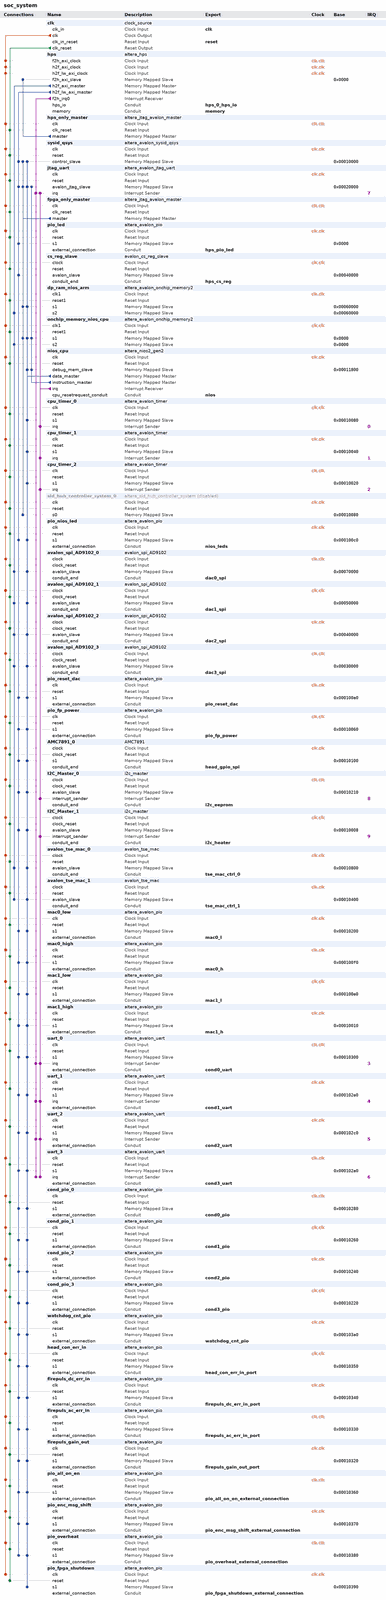
[diagram p0: system contents, whole]
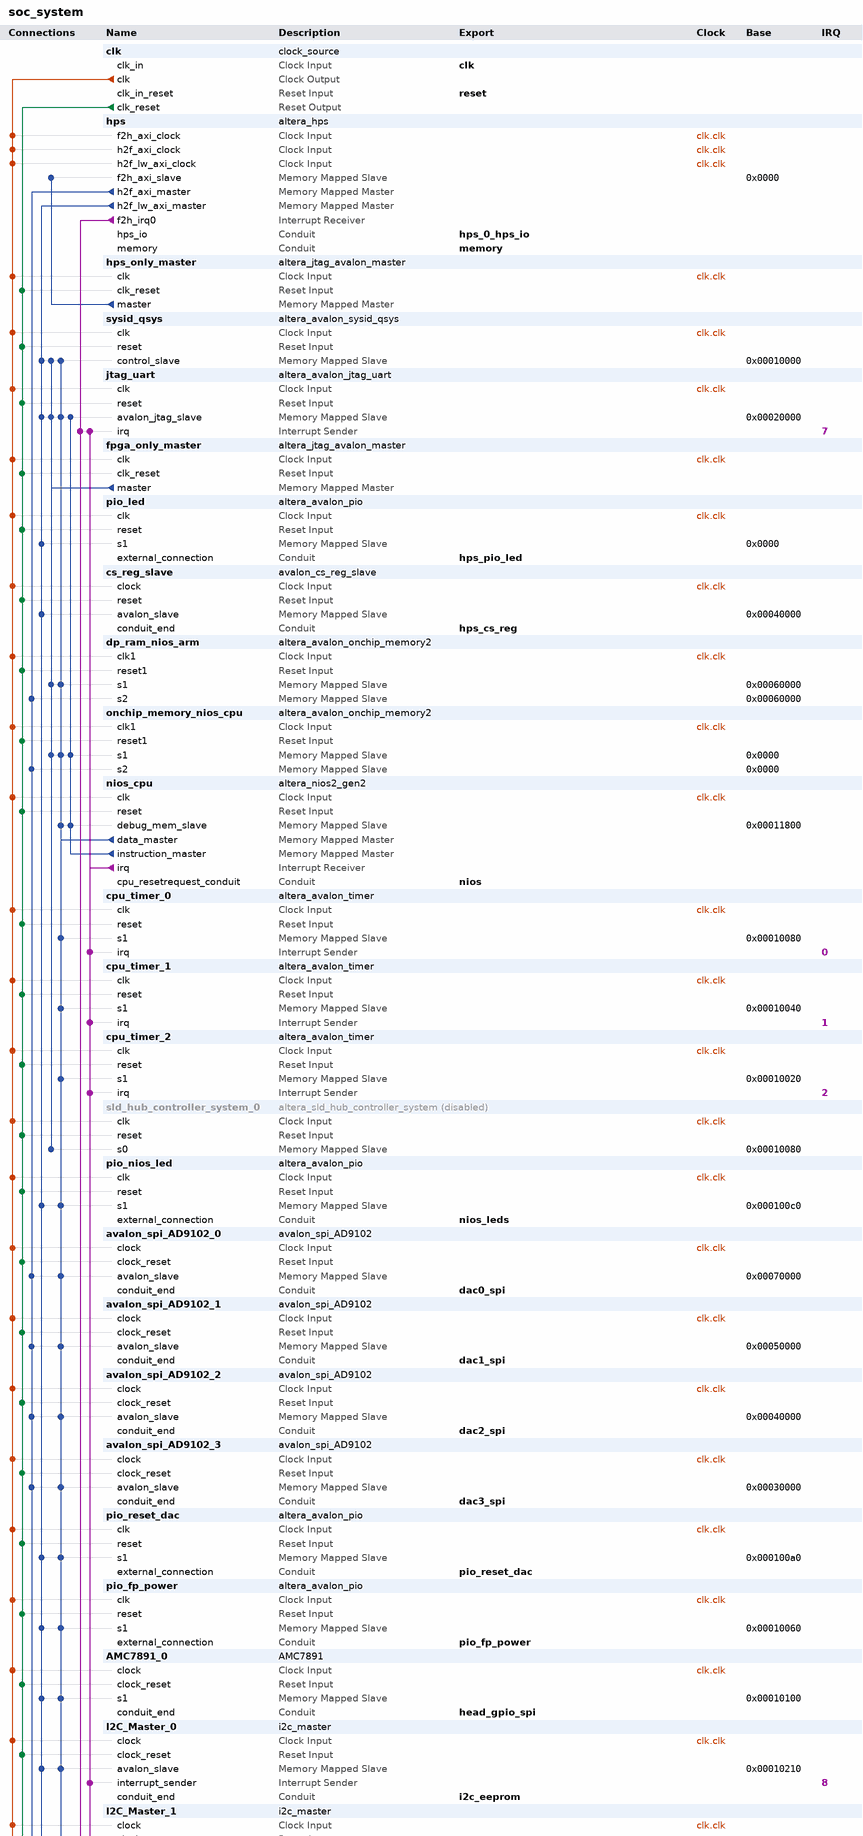
[diagram p1: system contents, upper part]
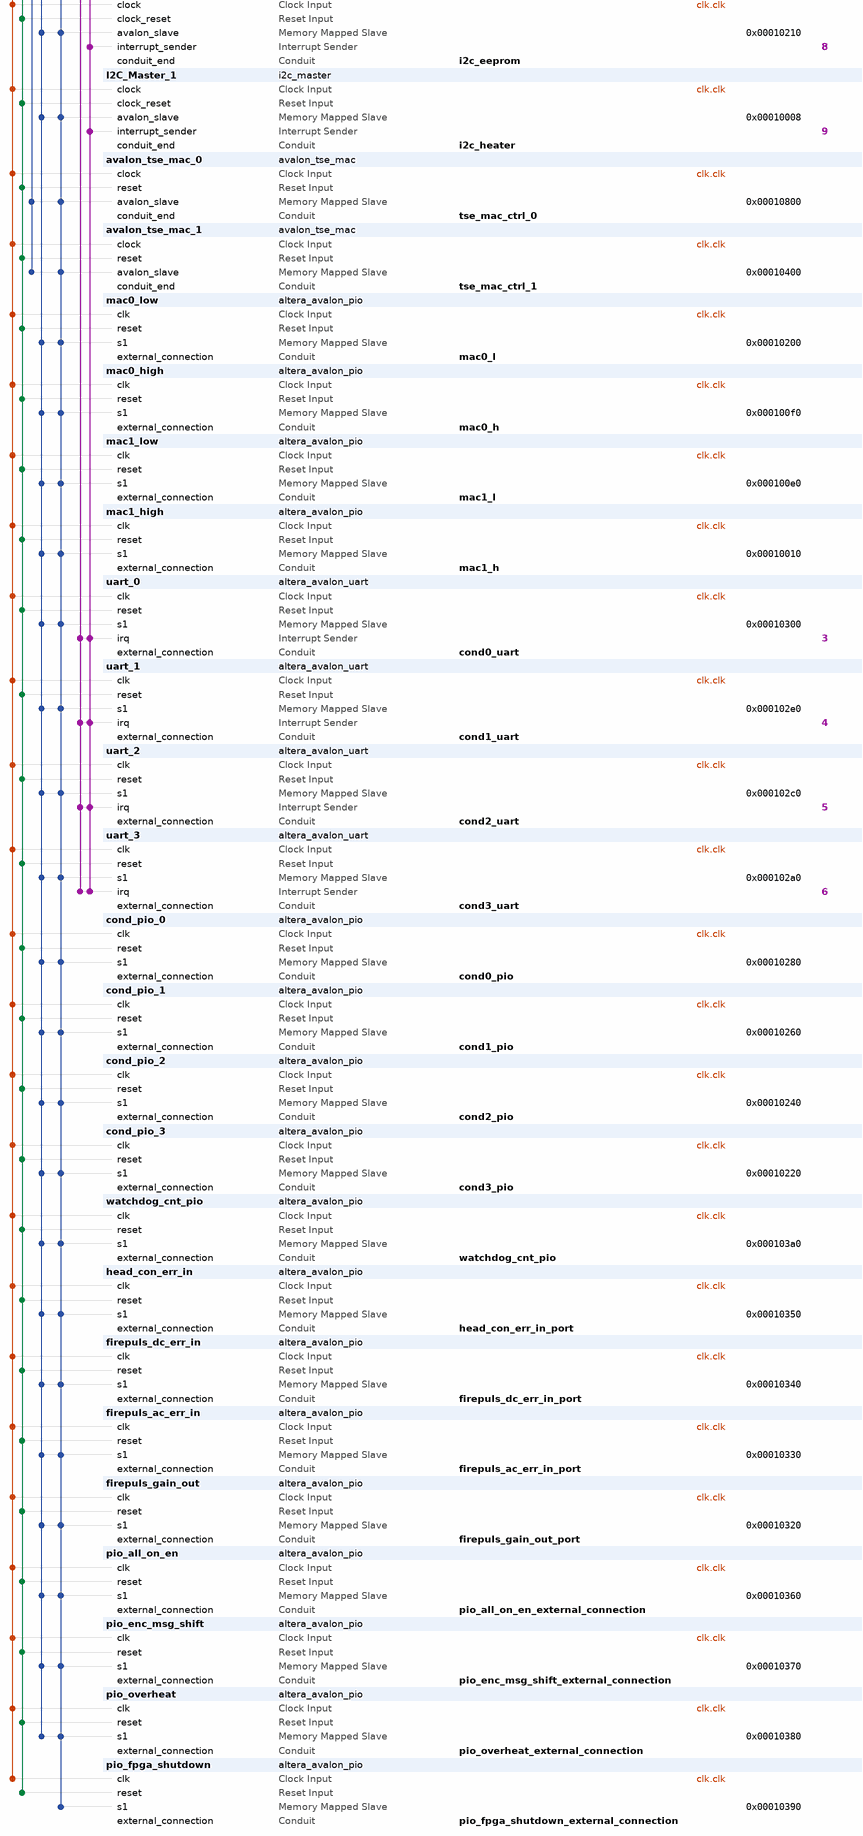
[diagram p2: system contents, lower part]
# Platform Designer (Qsys) system soc_system, Arria V 5ASXMB3G6F40C6
# Parameters at their usual value, and those the tool derives, are not listed.
package require -exact qsys 17.1
create_system soc_system
set_project_property DEVICE_FAMILY {Arria V}
set_project_property DEVICE 5ASXMB3G6F40C6

add_instance clk clock_source 17.1
set_instance_parameter_value clk clockFrequency 50000000

add_instance hps altera_hps 17.1
set_instance_parameter_value hps EMAC1_Mode RGMII
set_instance_parameter_value hps EMAC1_PinMuxing {HPS I/O Set 0}
set_instance_parameter_value hps F2SCLK_COLDRST_Enable false
set_instance_parameter_value hps F2SCLK_DBGRST_Enable false
set_instance_parameter_value hps F2SCLK_WARMRST_Enable false
set_instance_parameter_value hps F2SINTERRUPT_Enable true
set_instance_parameter_value hps F2S_Width 2
set_instance_parameter_value hps FPGA_PERIPHERAL_OUTPUT_CLOCK_FREQ_EMAC0_GTX_CLK 100
set_instance_parameter_value hps FPGA_PERIPHERAL_OUTPUT_CLOCK_FREQ_EMAC0_MD_CLK 100.0
set_instance_parameter_value hps FPGA_PERIPHERAL_OUTPUT_CLOCK_FREQ_EMAC1_GTX_CLK 100
set_instance_parameter_value hps FPGA_PERIPHERAL_OUTPUT_CLOCK_FREQ_EMAC1_MD_CLK 100.0
set_instance_parameter_value hps HPS_PROTOCOL DDR3
set_instance_parameter_value hps I2C0_Mode N/A
set_instance_parameter_value hps I2C0_PinMuxing Unused
set_instance_parameter_value hps I2C1_Mode N/A
set_instance_parameter_value hps I2C1_PinMuxing Unused
set_instance_parameter_value hps LWH2F_Enable true
set_instance_parameter_value hps MEM_BANKADDR_WIDTH 3
set_instance_parameter_value hps MEM_CLK_FREQ 400.0
set_instance_parameter_value hps MEM_COL_ADDR_WIDTH 10
set_instance_parameter_value hps MEM_DQ_WIDTH 32
set_instance_parameter_value hps MEM_DRV_STR RZQ/6
set_instance_parameter_value hps MEM_ROW_ADDR_WIDTH 15
set_instance_parameter_value hps MEM_RTT_NOM RZQ/4
set_instance_parameter_value hps MEM_RTT_WR {Dynamic ODT off}
set_instance_parameter_value hps MEM_TCL 7
set_instance_parameter_value hps MEM_TFAW_NS 40.0
set_instance_parameter_value hps MEM_TRAS_NS 35.0
set_instance_parameter_value hps MEM_TRCD_NS 13.75
set_instance_parameter_value hps MEM_TRFC_NS 260.0
set_instance_parameter_value hps MEM_TRP_NS 13.75
set_instance_parameter_value hps MEM_TRRD_NS 10.0
set_instance_parameter_value hps MEM_TRTP_NS 10.0
set_instance_parameter_value hps MEM_VENDOR Samsung
set_instance_parameter_value hps MEM_WTCL 6
set_instance_parameter_value hps QSPI_Mode {1 SS}
set_instance_parameter_value hps QSPI_PinMuxing {HPS I/O Set 0}
set_instance_parameter_value hps REF_CLK_FREQ 25.0
set_instance_parameter_value hps S2FCLK_USER2CLK 1
set_instance_parameter_value hps S2F_Width 2
set_instance_parameter_value hps SDIO_Mode {4-bit Data}
set_instance_parameter_value hps SDIO_PinMuxing {HPS I/O Set 0}
set_instance_parameter_value hps SPIM1_Mode N/A
set_instance_parameter_value hps SPIM1_PinMuxing Unused
set_instance_parameter_value hps STM_Enable false
set_instance_parameter_value hps TIMING_BOARD_AC_SKEW 0.0
set_instance_parameter_value hps TIMING_BOARD_AC_TO_CK_SKEW 0.0
set_instance_parameter_value hps TIMING_BOARD_DQ_TO_DQS_SKEW 0.0
set_instance_parameter_value hps TIMING_BOARD_MAX_CK_DELAY 0.36
set_instance_parameter_value hps TIMING_BOARD_MAX_DQS_DELAY 0.21
set_instance_parameter_value hps TIMING_BOARD_SKEW_BETWEEN_DQS 0.0
set_instance_parameter_value hps TIMING_BOARD_SKEW_CKDQS_DIMM_MAX 0.15
set_instance_parameter_value hps TIMING_BOARD_SKEW_CKDQS_DIMM_MIN 0.15
set_instance_parameter_value hps TIMING_BOARD_SKEW_WITHIN_DQS 0.0
set_instance_parameter_value hps TIMING_TDH 45
set_instance_parameter_value hps TIMING_TDQSCK 225
set_instance_parameter_value hps TIMING_TDQSQ 100
set_instance_parameter_value hps TIMING_TDQSS 0.27
set_instance_parameter_value hps TIMING_TDS 10
set_instance_parameter_value hps TIMING_TDSH 0.18
set_instance_parameter_value hps TIMING_TDSS 0.18
set_instance_parameter_value hps TIMING_TIH 120
set_instance_parameter_value hps TIMING_TIS 170
set_instance_parameter_value hps TIMING_TQSH 0.4
set_instance_parameter_value hps UART0_Mode {No Flow Control}
set_instance_parameter_value hps UART0_PinMuxing {HPS I/O Set 1}
set_instance_parameter_value hps USB1_Mode N/A
set_instance_parameter_value hps USB1_PinMuxing Unused
set_instance_parameter_value hps desired_cfg_clk_mhz 100.0
set_instance_parameter_value hps desired_qspi_clk_mhz 350.0

add_instance hps_only_master altera_jtag_avalon_master 17.1

add_instance sysid_qsys altera_avalon_sysid_qsys 17.1
set_instance_parameter_value sysid_qsys id -1395322108

add_instance jtag_uart altera_avalon_jtag_uart 17.1
set_instance_parameter_value jtag_uart allowMultipleConnections true
set_instance_parameter_value jtag_uart simInteractiveOptions INTERACTIVE_ASCII_OUTPUT

add_instance fpga_only_master altera_jtag_avalon_master 17.1

add_instance pio_led altera_avalon_pio 17.1
set_instance_parameter_value pio_led direction Output
set_instance_parameter_value pio_led width 1

add_instance cs_reg_slave avalon_cs_reg_slave 1.0
set_instance_parameter_value cs_reg_slave g_addr_width 16
set_instance_parameter_value cs_reg_slave g_data_width 32

add_instance dp_ram_nios_arm altera_avalon_onchip_memory2 17.1
set_instance_parameter_value dp_ram_nios_arm dataWidth 16
set_instance_parameter_value dp_ram_nios_arm dualPort true
set_instance_parameter_value dp_ram_nios_arm initMemContent true
set_instance_parameter_value dp_ram_nios_arm initializationFileName onchip_mem.hex
set_instance_parameter_value dp_ram_nios_arm memorySize 32768
set_instance_parameter_value dp_ram_nios_arm singleClockOperation true

add_instance onchip_memory_nios_cpu altera_avalon_onchip_memory2 17.1
set_instance_parameter_value onchip_memory_nios_cpu dataWidth 32
set_instance_parameter_value onchip_memory_nios_cpu dualPort true
set_instance_parameter_value onchip_memory_nios_cpu initMemContent true
set_instance_parameter_value onchip_memory_nios_cpu initializationFileName onchip_mem.hex
set_instance_parameter_value onchip_memory_nios_cpu memorySize 65536
set_instance_parameter_value onchip_memory_nios_cpu singleClockOperation true

add_instance nios_cpu altera_nios2_gen2 17.1
set_instance_parameter_value nios_cpu cpuReset true
set_instance_parameter_value nios_cpu dcache_size 0
set_instance_parameter_value nios_cpu exceptionSlave onchip_memory_nios_cpu.s1
set_instance_parameter_value nios_cpu icache_size 512
set_instance_parameter_value nios_cpu impl Fast
set_instance_parameter_value nios_cpu resetSlave onchip_memory_nios_cpu.s1
set_instance_parameter_value nios_cpu setting_activateTrace true

add_instance cpu_timer_0 altera_avalon_timer 17.1
set_instance_parameter_value cpu_timer_0 period 1
set_instance_parameter_value cpu_timer_0 periodUnits MSEC

add_instance cpu_timer_1 altera_avalon_timer 17.1
set_instance_parameter_value cpu_timer_1 period 1
set_instance_parameter_value cpu_timer_1 periodUnits MSEC

add_instance cpu_timer_2 altera_avalon_timer 17.1
set_instance_parameter_value cpu_timer_2 period 1
set_instance_parameter_value cpu_timer_2 periodUnits MSEC

add_instance sld_hub_controller_system_0 altera_sld_hub_controller_system 17.1
set_instance_property sld_hub_controller_system_0 ENABLED false
set_instance_parameter_value sld_hub_controller_system_0 ENABLE_JTAG_IO_SELECTION 0

add_instance pio_nios_led altera_avalon_pio 17.1
set_instance_parameter_value pio_nios_led bitModifyingOutReg true
set_instance_parameter_value pio_nios_led direction Output
set_instance_parameter_value pio_nios_led width 2

add_instance avalon_spi_AD9102_0 avalon_spi_AD9102 1.0

add_instance avalon_spi_AD9102_1 avalon_spi_AD9102 1.0

add_instance avalon_spi_AD9102_2 avalon_spi_AD9102 1.0

add_instance avalon_spi_AD9102_3 avalon_spi_AD9102 1.0

add_instance pio_reset_dac altera_avalon_pio 17.1
set_instance_parameter_value pio_reset_dac bitModifyingOutReg true
set_instance_parameter_value pio_reset_dac direction Output
set_instance_parameter_value pio_reset_dac width 4

add_instance pio_fp_power altera_avalon_pio 17.1
set_instance_parameter_value pio_fp_power bitModifyingOutReg true
set_instance_parameter_value pio_fp_power direction Output
set_instance_parameter_value pio_fp_power width 1

add_instance AMC7891_0 AMC7891 1.0

add_instance I2C_Master_0 i2c_master 14.0

add_instance I2C_Master_1 i2c_master 14.0

add_instance avalon_tse_mac_0 avalon_tse_mac 1.0

add_instance avalon_tse_mac_1 avalon_tse_mac 1.0

add_instance mac0_low altera_avalon_pio 17.1
set_instance_parameter_value mac0_low direction Input
set_instance_parameter_value mac0_low width 32

add_instance mac0_high altera_avalon_pio 17.1
set_instance_parameter_value mac0_high direction Input
set_instance_parameter_value mac0_high width 16

add_instance mac1_low altera_avalon_pio 17.1
set_instance_parameter_value mac1_low direction Input
set_instance_parameter_value mac1_low width 32

add_instance mac1_high altera_avalon_pio 17.1
set_instance_parameter_value mac1_high direction Input
set_instance_parameter_value mac1_high width 16

add_instance uart_0 altera_avalon_uart 17.1
set_instance_parameter_value uart_0 baud 115200
set_instance_parameter_value uart_0 dataBits 8
set_instance_parameter_value uart_0 fixedBaud false
set_instance_parameter_value uart_0 parity NONE
set_instance_parameter_value uart_0 stopBits 1

add_instance uart_1 altera_avalon_uart 17.1
set_instance_parameter_value uart_1 baud 115200
set_instance_parameter_value uart_1 dataBits 8
set_instance_parameter_value uart_1 fixedBaud false
set_instance_parameter_value uart_1 parity NONE
set_instance_parameter_value uart_1 stopBits 1

add_instance uart_2 altera_avalon_uart 17.1
set_instance_parameter_value uart_2 baud 115200
set_instance_parameter_value uart_2 dataBits 8
set_instance_parameter_value uart_2 fixedBaud false
set_instance_parameter_value uart_2 parity NONE
set_instance_parameter_value uart_2 stopBits 1

add_instance uart_3 altera_avalon_uart 17.1
set_instance_parameter_value uart_3 baud 115200
set_instance_parameter_value uart_3 dataBits 8
set_instance_parameter_value uart_3 fixedBaud false
set_instance_parameter_value uart_3 parity NONE
set_instance_parameter_value uart_3 stopBits 1

add_instance cond_pio_0 altera_avalon_pio 17.1
set_instance_parameter_value cond_pio_0 bitModifyingOutReg true
set_instance_parameter_value cond_pio_0 direction Output
set_instance_parameter_value cond_pio_0 resetValue 1
set_instance_parameter_value cond_pio_0 width 4

add_instance cond_pio_1 altera_avalon_pio 17.1
set_instance_parameter_value cond_pio_1 bitModifyingOutReg true
set_instance_parameter_value cond_pio_1 direction Output
set_instance_parameter_value cond_pio_1 resetValue 1
set_instance_parameter_value cond_pio_1 width 4

add_instance cond_pio_2 altera_avalon_pio 17.1
set_instance_parameter_value cond_pio_2 bitModifyingOutReg true
set_instance_parameter_value cond_pio_2 direction Output
set_instance_parameter_value cond_pio_2 resetValue 1
set_instance_parameter_value cond_pio_2 width 4

add_instance cond_pio_3 altera_avalon_pio 17.1
set_instance_parameter_value cond_pio_3 bitModifyingOutReg true
set_instance_parameter_value cond_pio_3 direction Output
set_instance_parameter_value cond_pio_3 resetValue 1
set_instance_parameter_value cond_pio_3 width 4

add_instance watchdog_cnt_pio altera_avalon_pio 17.1
set_instance_parameter_value watchdog_cnt_pio bitModifyingOutReg true
set_instance_parameter_value watchdog_cnt_pio direction Output
set_instance_parameter_value watchdog_cnt_pio width 32

add_instance head_con_err_in altera_avalon_pio 17.1
set_instance_parameter_value head_con_err_in direction Input
set_instance_parameter_value head_con_err_in width 4

add_instance firepuls_dc_err_in altera_avalon_pio 17.1
set_instance_parameter_value firepuls_dc_err_in direction Input
set_instance_parameter_value firepuls_dc_err_in width 4

add_instance firepuls_ac_err_in altera_avalon_pio 17.1
set_instance_parameter_value firepuls_ac_err_in direction Input
set_instance_parameter_value firepuls_ac_err_in width 4

add_instance firepuls_gain_out altera_avalon_pio 17.1
set_instance_parameter_value firepuls_gain_out direction Output
set_instance_parameter_value firepuls_gain_out width 4

add_instance pio_all_on_en altera_avalon_pio 17.1
set_instance_parameter_value pio_all_on_en direction Output
set_instance_parameter_value pio_all_on_en width 1

add_instance pio_enc_msg_shift altera_avalon_pio 17.1
set_instance_parameter_value pio_enc_msg_shift direction Output
set_instance_parameter_value pio_enc_msg_shift width 2

add_instance pio_overheat altera_avalon_pio 17.1
set_instance_parameter_value pio_overheat captureEdge true
set_instance_parameter_value pio_overheat direction Input
set_instance_parameter_value pio_overheat irqType EDGE
set_instance_parameter_value pio_overheat width 1

add_instance pio_fpga_shutdown altera_avalon_pio 17.1
set_instance_parameter_value pio_fpga_shutdown direction Output
set_instance_parameter_value pio_fpga_shutdown width 1

# connections
add_connection clk.clk AMC7891_0.clock clock
add_connection clk.clk avalon_spi_AD9102_0.clock clock
add_connection clk.clk avalon_spi_AD9102_1.clock clock
add_connection clk.clk avalon_spi_AD9102_2.clock clock
add_connection clk.clk avalon_spi_AD9102_3.clock clock
add_connection clk.clk avalon_tse_mac_0.clock clock
add_connection clk.clk avalon_tse_mac_1.clock clock
add_connection clk.clk cond_pio_0.clk clock
add_connection clk.clk cond_pio_1.clk clock
add_connection clk.clk cond_pio_2.clk clock
add_connection clk.clk cond_pio_3.clk clock
add_connection clk.clk cpu_timer_0.clk clock
add_connection clk.clk cpu_timer_1.clk clock
add_connection clk.clk cpu_timer_2.clk clock
add_connection clk.clk cs_reg_slave.clock clock
add_connection clk.clk dp_ram_nios_arm.clk1 clock
add_connection clk.clk firepuls_ac_err_in.clk clock
add_connection clk.clk firepuls_dc_err_in.clk clock
add_connection clk.clk firepuls_gain_out.clk clock
add_connection clk.clk fpga_only_master.clk clock
add_connection clk.clk head_con_err_in.clk clock
add_connection clk.clk hps.f2h_axi_clock clock
add_connection clk.clk hps.h2f_axi_clock clock
add_connection clk.clk hps.h2f_lw_axi_clock clock
add_connection clk.clk hps_only_master.clk clock
add_connection clk.clk I2C_Master_0.clock clock
add_connection clk.clk I2C_Master_1.clock clock
add_connection clk.clk jtag_uart.clk clock
add_connection clk.clk mac0_high.clk clock
add_connection clk.clk mac0_low.clk clock
add_connection clk.clk mac1_high.clk clock
add_connection clk.clk mac1_low.clk clock
add_connection clk.clk nios_cpu.clk clock
add_connection clk.clk onchip_memory_nios_cpu.clk1 clock
add_connection clk.clk pio_all_on_en.clk clock
add_connection clk.clk pio_enc_msg_shift.clk clock
add_connection clk.clk pio_fp_power.clk clock
add_connection clk.clk pio_fpga_shutdown.clk clock
add_connection clk.clk pio_led.clk clock
add_connection clk.clk pio_nios_led.clk clock
add_connection clk.clk pio_overheat.clk clock
add_connection clk.clk pio_reset_dac.clk clock
add_connection clk.clk sld_hub_controller_system_0.clk clock
add_connection clk.clk sysid_qsys.clk clock
add_connection clk.clk uart_0.clk clock
add_connection clk.clk uart_1.clk clock
add_connection clk.clk uart_2.clk clock
add_connection clk.clk uart_3.clk clock
add_connection clk.clk watchdog_cnt_pio.clk clock
add_connection clk.clk_reset AMC7891_0.clock_reset reset
add_connection clk.clk_reset avalon_spi_AD9102_0.clock_reset reset
add_connection clk.clk_reset avalon_spi_AD9102_1.clock_reset reset
add_connection clk.clk_reset avalon_spi_AD9102_2.clock_reset reset
add_connection clk.clk_reset avalon_spi_AD9102_3.clock_reset reset
add_connection clk.clk_reset avalon_tse_mac_0.reset reset
add_connection clk.clk_reset avalon_tse_mac_1.reset reset
add_connection clk.clk_reset cond_pio_0.reset reset
add_connection clk.clk_reset cond_pio_1.reset reset
add_connection clk.clk_reset cond_pio_2.reset reset
add_connection clk.clk_reset cond_pio_3.reset reset
add_connection clk.clk_reset cpu_timer_0.reset reset
add_connection clk.clk_reset cpu_timer_1.reset reset
add_connection clk.clk_reset cpu_timer_2.reset reset
add_connection clk.clk_reset cs_reg_slave.reset reset
add_connection clk.clk_reset dp_ram_nios_arm.reset1 reset
add_connection clk.clk_reset firepuls_ac_err_in.reset reset
add_connection clk.clk_reset firepuls_dc_err_in.reset reset
add_connection clk.clk_reset firepuls_gain_out.reset reset
add_connection clk.clk_reset fpga_only_master.clk_reset reset
add_connection clk.clk_reset head_con_err_in.reset reset
add_connection clk.clk_reset hps_only_master.clk_reset reset
add_connection clk.clk_reset I2C_Master_0.clock_reset reset
add_connection clk.clk_reset I2C_Master_1.clock_reset reset
add_connection clk.clk_reset jtag_uart.reset reset
add_connection clk.clk_reset mac0_high.reset reset
add_connection clk.clk_reset mac0_low.reset reset
add_connection clk.clk_reset mac1_high.reset reset
add_connection clk.clk_reset mac1_low.reset reset
add_connection clk.clk_reset nios_cpu.reset reset
add_connection clk.clk_reset onchip_memory_nios_cpu.reset1 reset
add_connection clk.clk_reset pio_all_on_en.reset reset
add_connection clk.clk_reset pio_enc_msg_shift.reset reset
add_connection clk.clk_reset pio_fp_power.reset reset
add_connection clk.clk_reset pio_fpga_shutdown.reset reset
add_connection clk.clk_reset pio_led.reset reset
add_connection clk.clk_reset pio_nios_led.reset reset
add_connection clk.clk_reset pio_overheat.reset reset
add_connection clk.clk_reset pio_reset_dac.reset reset
add_connection clk.clk_reset sld_hub_controller_system_0.reset reset
add_connection clk.clk_reset sysid_qsys.reset reset
add_connection clk.clk_reset uart_0.reset reset
add_connection clk.clk_reset uart_1.reset reset
add_connection clk.clk_reset uart_2.reset reset
add_connection clk.clk_reset uart_3.reset reset
add_connection clk.clk_reset watchdog_cnt_pio.reset reset
add_connection fpga_only_master.master dp_ram_nios_arm.s1 avalon
set_connection_parameter_value fpga_only_master.master/dp_ram_nios_arm.s1 baseAddress 0x00060000
add_connection fpga_only_master.master jtag_uart.avalon_jtag_slave avalon
set_connection_parameter_value fpga_only_master.master/jtag_uart.avalon_jtag_slave baseAddress 0x00020000
add_connection fpga_only_master.master onchip_memory_nios_cpu.s1 avalon
set_connection_parameter_value fpga_only_master.master/onchip_memory_nios_cpu.s1 baseAddress 0x0000
add_connection fpga_only_master.master sld_hub_controller_system_0.s0 avalon
set_connection_parameter_value fpga_only_master.master/sld_hub_controller_system_0.s0 baseAddress 0x00010080
add_connection fpga_only_master.master sysid_qsys.control_slave avalon
set_connection_parameter_value fpga_only_master.master/sysid_qsys.control_slave baseAddress 0x00010000
add_connection hps.h2f_axi_master avalon_spi_AD9102_0.avalon_slave avalon
set_connection_parameter_value hps.h2f_axi_master/avalon_spi_AD9102_0.avalon_slave baseAddress 0x00070000
add_connection hps.h2f_axi_master avalon_spi_AD9102_1.avalon_slave avalon
set_connection_parameter_value hps.h2f_axi_master/avalon_spi_AD9102_1.avalon_slave baseAddress 0x00050000
add_connection hps.h2f_axi_master avalon_spi_AD9102_2.avalon_slave avalon
set_connection_parameter_value hps.h2f_axi_master/avalon_spi_AD9102_2.avalon_slave baseAddress 0x00040000
add_connection hps.h2f_axi_master avalon_spi_AD9102_3.avalon_slave avalon
set_connection_parameter_value hps.h2f_axi_master/avalon_spi_AD9102_3.avalon_slave baseAddress 0x00030000
add_connection hps.h2f_axi_master avalon_tse_mac_0.avalon_slave avalon
set_connection_parameter_value hps.h2f_axi_master/avalon_tse_mac_0.avalon_slave baseAddress 0x00010800
add_connection hps.h2f_axi_master avalon_tse_mac_1.avalon_slave avalon
set_connection_parameter_value hps.h2f_axi_master/avalon_tse_mac_1.avalon_slave baseAddress 0x00010400
add_connection hps.h2f_axi_master dp_ram_nios_arm.s2 avalon
set_connection_parameter_value hps.h2f_axi_master/dp_ram_nios_arm.s2 baseAddress 0x00060000
add_connection hps.h2f_axi_master onchip_memory_nios_cpu.s2 avalon
set_connection_parameter_value hps.h2f_axi_master/onchip_memory_nios_cpu.s2 baseAddress 0x0000
add_connection hps.h2f_lw_axi_master AMC7891_0.s1 avalon
set_connection_parameter_value hps.h2f_lw_axi_master/AMC7891_0.s1 baseAddress 0x00010100
add_connection hps.h2f_lw_axi_master cond_pio_0.s1 avalon
set_connection_parameter_value hps.h2f_lw_axi_master/cond_pio_0.s1 baseAddress 0x00010280
add_connection hps.h2f_lw_axi_master cond_pio_1.s1 avalon
set_connection_parameter_value hps.h2f_lw_axi_master/cond_pio_1.s1 baseAddress 0x00010260
add_connection hps.h2f_lw_axi_master cond_pio_2.s1 avalon
set_connection_parameter_value hps.h2f_lw_axi_master/cond_pio_2.s1 baseAddress 0x00010240
add_connection hps.h2f_lw_axi_master cond_pio_3.s1 avalon
set_connection_parameter_value hps.h2f_lw_axi_master/cond_pio_3.s1 baseAddress 0x00010220
add_connection hps.h2f_lw_axi_master cs_reg_slave.avalon_slave avalon
set_connection_parameter_value hps.h2f_lw_axi_master/cs_reg_slave.avalon_slave baseAddress 0x00040000
add_connection hps.h2f_lw_axi_master firepuls_ac_err_in.s1 avalon
set_connection_parameter_value hps.h2f_lw_axi_master/firepuls_ac_err_in.s1 baseAddress 0x00010330
add_connection hps.h2f_lw_axi_master firepuls_dc_err_in.s1 avalon
set_connection_parameter_value hps.h2f_lw_axi_master/firepuls_dc_err_in.s1 baseAddress 0x00010340
add_connection hps.h2f_lw_axi_master firepuls_gain_out.s1 avalon
set_connection_parameter_value hps.h2f_lw_axi_master/firepuls_gain_out.s1 baseAddress 0x00010320
add_connection hps.h2f_lw_axi_master head_con_err_in.s1 avalon
set_connection_parameter_value hps.h2f_lw_axi_master/head_con_err_in.s1 baseAddress 0x00010350
add_connection hps.h2f_lw_axi_master I2C_Master_0.avalon_slave avalon
set_connection_parameter_value hps.h2f_lw_axi_master/I2C_Master_0.avalon_slave baseAddress 0x00010210
add_connection hps.h2f_lw_axi_master I2C_Master_1.avalon_slave avalon
set_connection_parameter_value hps.h2f_lw_axi_master/I2C_Master_1.avalon_slave baseAddress 0x00010008
add_connection hps.h2f_lw_axi_master jtag_uart.avalon_jtag_slave avalon
set_connection_parameter_value hps.h2f_lw_axi_master/jtag_uart.avalon_jtag_slave baseAddress 0x00020000
add_connection hps.h2f_lw_axi_master mac0_high.s1 avalon
set_connection_parameter_value hps.h2f_lw_axi_master/mac0_high.s1 baseAddress 0x000100f0
add_connection hps.h2f_lw_axi_master mac0_low.s1 avalon
set_connection_parameter_value hps.h2f_lw_axi_master/mac0_low.s1 baseAddress 0x00010200
add_connection hps.h2f_lw_axi_master mac1_high.s1 avalon
set_connection_parameter_value hps.h2f_lw_axi_master/mac1_high.s1 baseAddress 0x00010010
add_connection hps.h2f_lw_axi_master mac1_low.s1 avalon
set_connection_parameter_value hps.h2f_lw_axi_master/mac1_low.s1 baseAddress 0x000100e0
add_connection hps.h2f_lw_axi_master pio_all_on_en.s1 avalon
set_connection_parameter_value hps.h2f_lw_axi_master/pio_all_on_en.s1 baseAddress 0x00010360
add_connection hps.h2f_lw_axi_master pio_enc_msg_shift.s1 avalon
set_connection_parameter_value hps.h2f_lw_axi_master/pio_enc_msg_shift.s1 baseAddress 0x00010370
add_connection hps.h2f_lw_axi_master pio_fp_power.s1 avalon
set_connection_parameter_value hps.h2f_lw_axi_master/pio_fp_power.s1 baseAddress 0x00010060
add_connection hps.h2f_lw_axi_master pio_led.s1 avalon
set_connection_parameter_value hps.h2f_lw_axi_master/pio_led.s1 baseAddress 0x0000
add_connection hps.h2f_lw_axi_master pio_nios_led.s1 avalon
set_connection_parameter_value hps.h2f_lw_axi_master/pio_nios_led.s1 baseAddress 0x000100c0
add_connection hps.h2f_lw_axi_master pio_overheat.s1 avalon
set_connection_parameter_value hps.h2f_lw_axi_master/pio_overheat.s1 baseAddress 0x00010380
add_connection hps.h2f_lw_axi_master pio_reset_dac.s1 avalon
set_connection_parameter_value hps.h2f_lw_axi_master/pio_reset_dac.s1 baseAddress 0x000100a0
add_connection hps.h2f_lw_axi_master sysid_qsys.control_slave avalon
set_connection_parameter_value hps.h2f_lw_axi_master/sysid_qsys.control_slave baseAddress 0x00010000
add_connection hps.h2f_lw_axi_master uart_0.s1 avalon
set_connection_parameter_value hps.h2f_lw_axi_master/uart_0.s1 baseAddress 0x00010300
add_connection hps.h2f_lw_axi_master uart_1.s1 avalon
set_connection_parameter_value hps.h2f_lw_axi_master/uart_1.s1 baseAddress 0x000102e0
add_connection hps.h2f_lw_axi_master uart_2.s1 avalon
set_connection_parameter_value hps.h2f_lw_axi_master/uart_2.s1 baseAddress 0x000102c0
add_connection hps.h2f_lw_axi_master uart_3.s1 avalon
set_connection_parameter_value hps.h2f_lw_axi_master/uart_3.s1 baseAddress 0x000102a0
add_connection hps.h2f_lw_axi_master watchdog_cnt_pio.s1 avalon
set_connection_parameter_value hps.h2f_lw_axi_master/watchdog_cnt_pio.s1 baseAddress 0x000103a0
add_connection hps_only_master.master hps.f2h_axi_slave avalon
set_connection_parameter_value hps_only_master.master/hps.f2h_axi_slave baseAddress 0x0000
add_connection nios_cpu.data_master AMC7891_0.s1 avalon
set_connection_parameter_value nios_cpu.data_master/AMC7891_0.s1 baseAddress 0x00010100
add_connection nios_cpu.data_master avalon_spi_AD9102_0.avalon_slave avalon
set_connection_parameter_value nios_cpu.data_master/avalon_spi_AD9102_0.avalon_slave baseAddress 0x00070000
add_connection nios_cpu.data_master avalon_spi_AD9102_1.avalon_slave avalon
set_connection_parameter_value nios_cpu.data_master/avalon_spi_AD9102_1.avalon_slave baseAddress 0x00050000
add_connection nios_cpu.data_master avalon_spi_AD9102_2.avalon_slave avalon
set_connection_parameter_value nios_cpu.data_master/avalon_spi_AD9102_2.avalon_slave baseAddress 0x00040000
add_connection nios_cpu.data_master avalon_spi_AD9102_3.avalon_slave avalon
set_connection_parameter_value nios_cpu.data_master/avalon_spi_AD9102_3.avalon_slave baseAddress 0x00030000
add_connection nios_cpu.data_master avalon_tse_mac_0.avalon_slave avalon
set_connection_parameter_value nios_cpu.data_master/avalon_tse_mac_0.avalon_slave baseAddress 0x00010800
add_connection nios_cpu.data_master avalon_tse_mac_1.avalon_slave avalon
set_connection_parameter_value nios_cpu.data_master/avalon_tse_mac_1.avalon_slave baseAddress 0x00010400
add_connection nios_cpu.data_master cond_pio_0.s1 avalon
set_connection_parameter_value nios_cpu.data_master/cond_pio_0.s1 baseAddress 0x00010280
add_connection nios_cpu.data_master cond_pio_1.s1 avalon
set_connection_parameter_value nios_cpu.data_master/cond_pio_1.s1 baseAddress 0x00010260
add_connection nios_cpu.data_master cond_pio_2.s1 avalon
set_connection_parameter_value nios_cpu.data_master/cond_pio_2.s1 baseAddress 0x00010240
add_connection nios_cpu.data_master cond_pio_3.s1 avalon
set_connection_parameter_value nios_cpu.data_master/cond_pio_3.s1 baseAddress 0x00010220
add_connection nios_cpu.data_master cpu_timer_0.s1 avalon
set_connection_parameter_value nios_cpu.data_master/cpu_timer_0.s1 baseAddress 0x00010080
add_connection nios_cpu.data_master cpu_timer_1.s1 avalon
set_connection_parameter_value nios_cpu.data_master/cpu_timer_1.s1 baseAddress 0x00010040
add_connection nios_cpu.data_master cpu_timer_2.s1 avalon
set_connection_parameter_value nios_cpu.data_master/cpu_timer_2.s1 baseAddress 0x00010020
add_connection nios_cpu.data_master dp_ram_nios_arm.s1 avalon
set_connection_parameter_value nios_cpu.data_master/dp_ram_nios_arm.s1 baseAddress 0x00060000
add_connection nios_cpu.data_master firepuls_ac_err_in.s1 avalon
set_connection_parameter_value nios_cpu.data_master/firepuls_ac_err_in.s1 baseAddress 0x00010330
add_connection nios_cpu.data_master firepuls_dc_err_in.s1 avalon
set_connection_parameter_value nios_cpu.data_master/firepuls_dc_err_in.s1 baseAddress 0x00010340
add_connection nios_cpu.data_master firepuls_gain_out.s1 avalon
set_connection_parameter_value nios_cpu.data_master/firepuls_gain_out.s1 baseAddress 0x00010320
add_connection nios_cpu.data_master head_con_err_in.s1 avalon
set_connection_parameter_value nios_cpu.data_master/head_con_err_in.s1 baseAddress 0x00010350
add_connection nios_cpu.data_master I2C_Master_0.avalon_slave avalon
set_connection_parameter_value nios_cpu.data_master/I2C_Master_0.avalon_slave baseAddress 0x00010210
add_connection nios_cpu.data_master I2C_Master_1.avalon_slave avalon
set_connection_parameter_value nios_cpu.data_master/I2C_Master_1.avalon_slave baseAddress 0x00010008
add_connection nios_cpu.data_master jtag_uart.avalon_jtag_slave avalon
set_connection_parameter_value nios_cpu.data_master/jtag_uart.avalon_jtag_slave baseAddress 0x00020000
add_connection nios_cpu.data_master mac0_high.s1 avalon
set_connection_parameter_value nios_cpu.data_master/mac0_high.s1 baseAddress 0x000100f0
add_connection nios_cpu.data_master mac0_low.s1 avalon
set_connection_parameter_value nios_cpu.data_master/mac0_low.s1 baseAddress 0x00010200
add_connection nios_cpu.data_master mac1_high.s1 avalon
set_connection_parameter_value nios_cpu.data_master/mac1_high.s1 baseAddress 0x00010010
add_connection nios_cpu.data_master mac1_low.s1 avalon
set_connection_parameter_value nios_cpu.data_master/mac1_low.s1 baseAddress 0x000100e0
add_connection nios_cpu.data_master nios_cpu.debug_mem_slave avalon
set_connection_parameter_value nios_cpu.data_master/nios_cpu.debug_mem_slave baseAddress 0x00011800
add_connection nios_cpu.data_master onchip_memory_nios_cpu.s1 avalon
set_connection_parameter_value nios_cpu.data_master/onchip_memory_nios_cpu.s1 baseAddress 0x0000
add_connection nios_cpu.data_master pio_all_on_en.s1 avalon
set_connection_parameter_value nios_cpu.data_master/pio_all_on_en.s1 baseAddress 0x00010360
add_connection nios_cpu.data_master pio_enc_msg_shift.s1 avalon
set_connection_parameter_value nios_cpu.data_master/pio_enc_msg_shift.s1 baseAddress 0x00010370
add_connection nios_cpu.data_master pio_fp_power.s1 avalon
set_connection_parameter_value nios_cpu.data_master/pio_fp_power.s1 baseAddress 0x00010060
add_connection nios_cpu.data_master pio_fpga_shutdown.s1 avalon
set_connection_parameter_value nios_cpu.data_master/pio_fpga_shutdown.s1 baseAddress 0x00010390
add_connection nios_cpu.data_master pio_nios_led.s1 avalon
set_connection_parameter_value nios_cpu.data_master/pio_nios_led.s1 baseAddress 0x000100c0
add_connection nios_cpu.data_master pio_overheat.s1 avalon
set_connection_parameter_value nios_cpu.data_master/pio_overheat.s1 baseAddress 0x00010380
add_connection nios_cpu.data_master pio_reset_dac.s1 avalon
set_connection_parameter_value nios_cpu.data_master/pio_reset_dac.s1 baseAddress 0x000100a0
add_connection nios_cpu.data_master sysid_qsys.control_slave avalon
set_connection_parameter_value nios_cpu.data_master/sysid_qsys.control_slave baseAddress 0x00010000
add_connection nios_cpu.data_master uart_0.s1 avalon
set_connection_parameter_value nios_cpu.data_master/uart_0.s1 baseAddress 0x00010300
add_connection nios_cpu.data_master uart_1.s1 avalon
set_connection_parameter_value nios_cpu.data_master/uart_1.s1 baseAddress 0x000102e0
add_connection nios_cpu.data_master uart_2.s1 avalon
set_connection_parameter_value nios_cpu.data_master/uart_2.s1 baseAddress 0x000102c0
add_connection nios_cpu.data_master uart_3.s1 avalon
set_connection_parameter_value nios_cpu.data_master/uart_3.s1 baseAddress 0x000102a0
add_connection nios_cpu.data_master watchdog_cnt_pio.s1 avalon
set_connection_parameter_value nios_cpu.data_master/watchdog_cnt_pio.s1 baseAddress 0x000103a0
add_connection nios_cpu.instruction_master jtag_uart.avalon_jtag_slave avalon
set_connection_parameter_value nios_cpu.instruction_master/jtag_uart.avalon_jtag_slave baseAddress 0x00020000
add_connection nios_cpu.instruction_master nios_cpu.debug_mem_slave avalon
set_connection_parameter_value nios_cpu.instruction_master/nios_cpu.debug_mem_slave baseAddress 0x00011800
add_connection nios_cpu.instruction_master onchip_memory_nios_cpu.s1 avalon
set_connection_parameter_value nios_cpu.instruction_master/onchip_memory_nios_cpu.s1 baseAddress 0x0000
add_connection hps.f2h_irq0 jtag_uart.irq interrupt
set_connection_parameter_value hps.f2h_irq0/jtag_uart.irq irqNumber 0
add_connection hps.f2h_irq0 uart_0.irq interrupt
set_connection_parameter_value hps.f2h_irq0/uart_0.irq irqNumber 1
add_connection hps.f2h_irq0 uart_1.irq interrupt
set_connection_parameter_value hps.f2h_irq0/uart_1.irq irqNumber 2
add_connection hps.f2h_irq0 uart_2.irq interrupt
set_connection_parameter_value hps.f2h_irq0/uart_2.irq irqNumber 3
add_connection hps.f2h_irq0 uart_3.irq interrupt
set_connection_parameter_value hps.f2h_irq0/uart_3.irq irqNumber 4
add_connection nios_cpu.irq cpu_timer_0.irq interrupt
set_connection_parameter_value nios_cpu.irq/cpu_timer_0.irq irqNumber 0
add_connection nios_cpu.irq cpu_timer_1.irq interrupt
set_connection_parameter_value nios_cpu.irq/cpu_timer_1.irq irqNumber 1
add_connection nios_cpu.irq cpu_timer_2.irq interrupt
set_connection_parameter_value nios_cpu.irq/cpu_timer_2.irq irqNumber 2
add_connection nios_cpu.irq I2C_Master_0.interrupt_sender interrupt
set_connection_parameter_value nios_cpu.irq/I2C_Master_0.interrupt_sender irqNumber 8
add_connection nios_cpu.irq I2C_Master_1.interrupt_sender interrupt
set_connection_parameter_value nios_cpu.irq/I2C_Master_1.interrupt_sender irqNumber 9
add_connection nios_cpu.irq jtag_uart.irq interrupt
set_connection_parameter_value nios_cpu.irq/jtag_uart.irq irqNumber 7
add_connection nios_cpu.irq uart_0.irq interrupt
set_connection_parameter_value nios_cpu.irq/uart_0.irq irqNumber 3
add_connection nios_cpu.irq uart_1.irq interrupt
set_connection_parameter_value nios_cpu.irq/uart_1.irq irqNumber 4
add_connection nios_cpu.irq uart_2.irq interrupt
set_connection_parameter_value nios_cpu.irq/uart_2.irq irqNumber 5
add_connection nios_cpu.irq uart_3.irq interrupt
set_connection_parameter_value nios_cpu.irq/uart_3.irq irqNumber 6

# exported interfaces
add_interface clk clock sink
set_interface_property clk EXPORT_OF clk.clk_in
add_interface cond0_pio conduit end
set_interface_property cond0_pio EXPORT_OF cond_pio_0.external_connection
add_interface cond0_uart conduit end
set_interface_property cond0_uart EXPORT_OF uart_0.external_connection
add_interface cond1_pio conduit end
set_interface_property cond1_pio EXPORT_OF cond_pio_1.external_connection
add_interface cond1_uart conduit end
set_interface_property cond1_uart EXPORT_OF uart_1.external_connection
add_interface cond2_pio conduit end
set_interface_property cond2_pio EXPORT_OF cond_pio_2.external_connection
add_interface cond2_uart conduit end
set_interface_property cond2_uart EXPORT_OF uart_2.external_connection
add_interface cond3_pio conduit end
set_interface_property cond3_pio EXPORT_OF cond_pio_3.external_connection
add_interface cond3_uart conduit end
set_interface_property cond3_uart EXPORT_OF uart_3.external_connection
add_interface dac0_spi conduit end
set_interface_property dac0_spi EXPORT_OF avalon_spi_AD9102_0.conduit_end
add_interface dac1_spi conduit end
set_interface_property dac1_spi EXPORT_OF avalon_spi_AD9102_1.conduit_end
add_interface dac2_spi conduit end
set_interface_property dac2_spi EXPORT_OF avalon_spi_AD9102_2.conduit_end
add_interface dac3_spi conduit end
set_interface_property dac3_spi EXPORT_OF avalon_spi_AD9102_3.conduit_end
add_interface firepuls_ac_err_in_port conduit end
set_interface_property firepuls_ac_err_in_port EXPORT_OF firepuls_ac_err_in.external_connection
add_interface firepuls_dc_err_in_port conduit end
set_interface_property firepuls_dc_err_in_port EXPORT_OF firepuls_dc_err_in.external_connection
add_interface firepuls_gain_out_port conduit end
set_interface_property firepuls_gain_out_port EXPORT_OF firepuls_gain_out.external_connection
add_interface head_con_err_in_port conduit end
set_interface_property head_con_err_in_port EXPORT_OF head_con_err_in.external_connection
add_interface head_gpio_spi conduit end
set_interface_property head_gpio_spi EXPORT_OF AMC7891_0.conduit_end
add_interface hps_0_hps_io conduit end
set_interface_property hps_0_hps_io EXPORT_OF hps.hps_io
add_interface hps_cs_reg conduit end
set_interface_property hps_cs_reg EXPORT_OF cs_reg_slave.conduit_end
add_interface hps_pio_led conduit end
set_interface_property hps_pio_led EXPORT_OF pio_led.external_connection
add_interface i2c_eeprom conduit end
set_interface_property i2c_eeprom EXPORT_OF I2C_Master_0.conduit_end
add_interface i2c_heater conduit end
set_interface_property i2c_heater EXPORT_OF I2C_Master_1.conduit_end
add_interface mac0_h conduit end
set_interface_property mac0_h EXPORT_OF mac0_high.external_connection
add_interface mac0_l conduit end
set_interface_property mac0_l EXPORT_OF mac0_low.external_connection
add_interface mac1_h conduit end
set_interface_property mac1_h EXPORT_OF mac1_high.external_connection
add_interface mac1_l conduit end
set_interface_property mac1_l EXPORT_OF mac1_low.external_connection
add_interface memory conduit end
set_interface_property memory EXPORT_OF hps.memory
add_interface nios conduit end
set_interface_property nios EXPORT_OF nios_cpu.cpu_resetrequest_conduit
add_interface nios_leds conduit end
set_interface_property nios_leds EXPORT_OF pio_nios_led.external_connection
add_interface pio_all_on_en_external_connection conduit end
set_interface_property pio_all_on_en_external_connection EXPORT_OF pio_all_on_en.external_connection
add_interface pio_enc_msg_shift_external_connection conduit end
set_interface_property pio_enc_msg_shift_external_connection EXPORT_OF pio_enc_msg_shift.external_connection
add_interface pio_fp_power conduit end
set_interface_property pio_fp_power EXPORT_OF pio_fp_power.external_connection
add_interface pio_fpga_shutdown_external_connection conduit end
set_interface_property pio_fpga_shutdown_external_connection EXPORT_OF pio_fpga_shutdown.external_connection
add_interface pio_overheat_external_connection conduit end
set_interface_property pio_overheat_external_connection EXPORT_OF pio_overheat.external_connection
add_interface pio_reset_dac conduit end
set_interface_property pio_reset_dac EXPORT_OF pio_reset_dac.external_connection
add_interface reset reset sink
set_interface_property reset EXPORT_OF clk.clk_in_reset
add_interface tse_mac_ctrl_0 conduit end
set_interface_property tse_mac_ctrl_0 EXPORT_OF avalon_tse_mac_0.conduit_end
add_interface tse_mac_ctrl_1 conduit end
set_interface_property tse_mac_ctrl_1 EXPORT_OF avalon_tse_mac_1.conduit_end
add_interface watchdog_cnt_pio conduit end
set_interface_property watchdog_cnt_pio EXPORT_OF watchdog_cnt_pio.external_connection

set_interconnect_requirement {$system} qsys_mm.clockCrossingAdapter HANDSHAKE
set_interconnect_requirement {$system} qsys_mm.maxAdditionalLatency 1

save_system soc_system.qsys
